# Altium schematic sheet PowerSupply.SchDoc
size A4
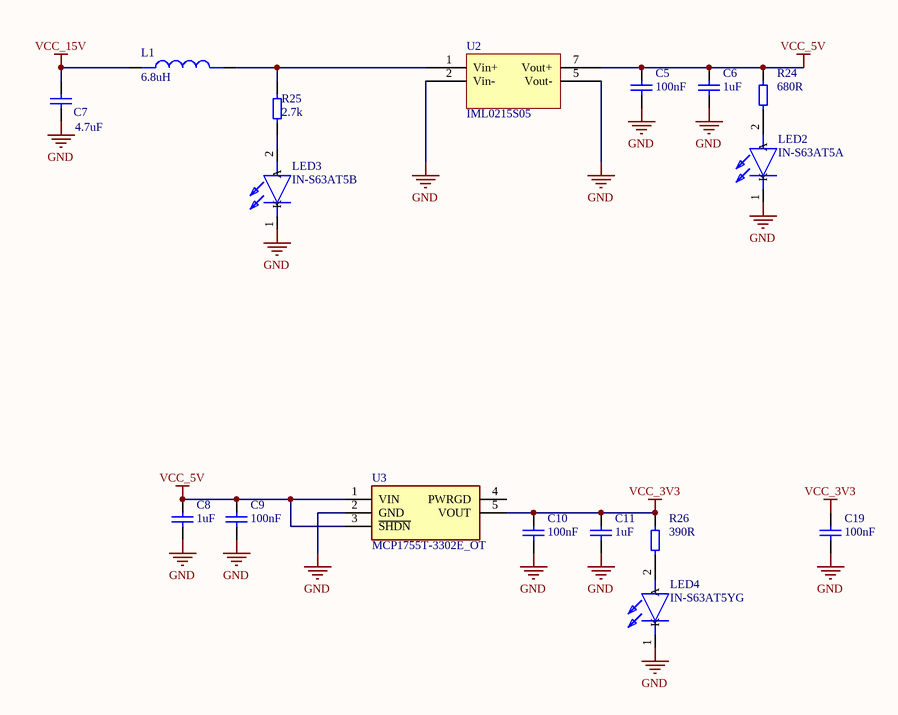
[diagram p0: PowerSupply.SchDoc]

## Parts
C5  100nF  [0603-Capacitor]
C6  1uF  [0603-Capacitor]
C7  4.7uF  [1206-Capacitor]
C8  1uF  [0603-Capacitor]
C9  100nF  [0603-Capacitor]
C10  100nF  [0603-Capacitor]
C11  1uF  [0603-Capacitor]
C19  100nF  [0603-Capacitor]
L1  6.8uH  [NRH2410T6R8MN]
LED2  IN-S63AT5A  [LEDM168X39N]
LED3  IN-S63AT5B  [LEDM168X39N]
LED4  IN-S63AT5YG  [LEDM168X39N]
R24  680R  [0603-Resistor]
R25  2.7k  [0805-Resistor]
R26  390R  [0603-Resistor]
U2  IML0215S05  [IML02S]
U3  MCP1755T-3302E_OT  [SOT95P270X145-5N]

## Nets
GND: C5.2 C6.2 C7.2 C8.2 C9.2 C10.2 C11.2 C19.2 LED2.1(K) LED3.1(K) LED4.1(K) U2.2(Vin-) U2.5(Vout-) U3.2(GND)
VCC_3V3: C10.1 C11.1 C19.1 R26.2 U3.5(VOUT)
VCC_5V: C5.1 C6.1 C8.1 C9.1 R24.2 U2.7(Vout+) U3.1(VIN) U3.3(~{SHDN})
VCC_15V: C7.1 L1.1(RF-IN)
NetL1_2: L1.2(RF-OUT) R25.2 U2.1(Vin+)
NetLED2_2: LED2.2(A) R24.1
NetLED3_2: LED3.2(A) R25.1
NetLED4_2: LED4.2(A) R26.1

Not connected (* = marked no-connect by the designer): U3 4(PWRGD)

## Library data of the parts
C5 C6 C8-C11 C19 = C0603: Capacitor; Part Number: C0603; Pin Count: 2; Manufacturer: *; Package: 0603; ManufacturerNr: *; Voltage Rating: *; Dielectric: *
  C5 C9 C10 C19: Value: 100nF
  C6 C8 C11: Value: 1uF
C7 = C1206: Capacitor; Part Number: C1206; Pin Count: 2; Manufacturer: *; Package: 1206; ManufacturerNr: *; Value: 4.7uF; Voltage Rating: *; Dielectric: *
L1 = LQG18HN22NJ00D: Chip Inductor; Manufacturer: Taiyo Yuden; Value: 6.8uH; Part Number: NRH2410T6R8MN; Pin Count: 2; ManufacturerNr: NRH2410T6R8MN
LED2-LED4 = IN-S63AT5G: LED; Manufacturer_Name: Inolux; Datasheet Link: http://www.inolux-corp.com/datasheet/SMDLED/Mono%20Color%20Top%20View/IN-S63AT%20Series_V1.1.pdf; Height: 0.39mm; Mouser Part Number: 743-IN-S63AT5G; Mouser Price/Stock: https://www.mouser.com/Search/Refine.aspx?Keyword=743-IN-S63AT5G
  LED2: Manufacturer_Part_Number: IN-S63AT5A
  LED3: Manufacturer_Part_Number: IN-S63AT5B
  LED4: Manufacturer_Part_Number: IN-S63AT5YG
R24 = R0603: Resistor; Part Number: R0603; Pin Count: 2; Manufacturer: *; Package: 0603; ManufacturerNr: *; Value: 680R
R25 = R0805: Resistor; Part Number: R0805; Pin Count: 2; Manufacturer: *; Package: 0805; ManufacturerNr: *; Value: 2.7k
R26 = R0603: Resistor; Part Number: R0603; Value: 680R; Pin Count: 2; Manufacturer: *; Package: 0603; ManufacturerNr: *
U2 = IML0215S05: XP power converter 15V->5V, 400mA; Manufacturer: XP Power; Manufacturer Nr: IML0215S05
U3 = MCP1755T-3302E_OT: Undefined or Miscellaneous; Manufacturer_Name: Microchip; Manufacturer_Part_Number: MCP1755T-3302E/OT; Datasheet Link: https://componentsearchengine.com/Datasheets/1/MCP1755T-3302E_OT.pdf; Height: 1.45mm